# Altium schematic sheet ESP32_LHCbit.SchDoc
size A3; SheetNumber: 1
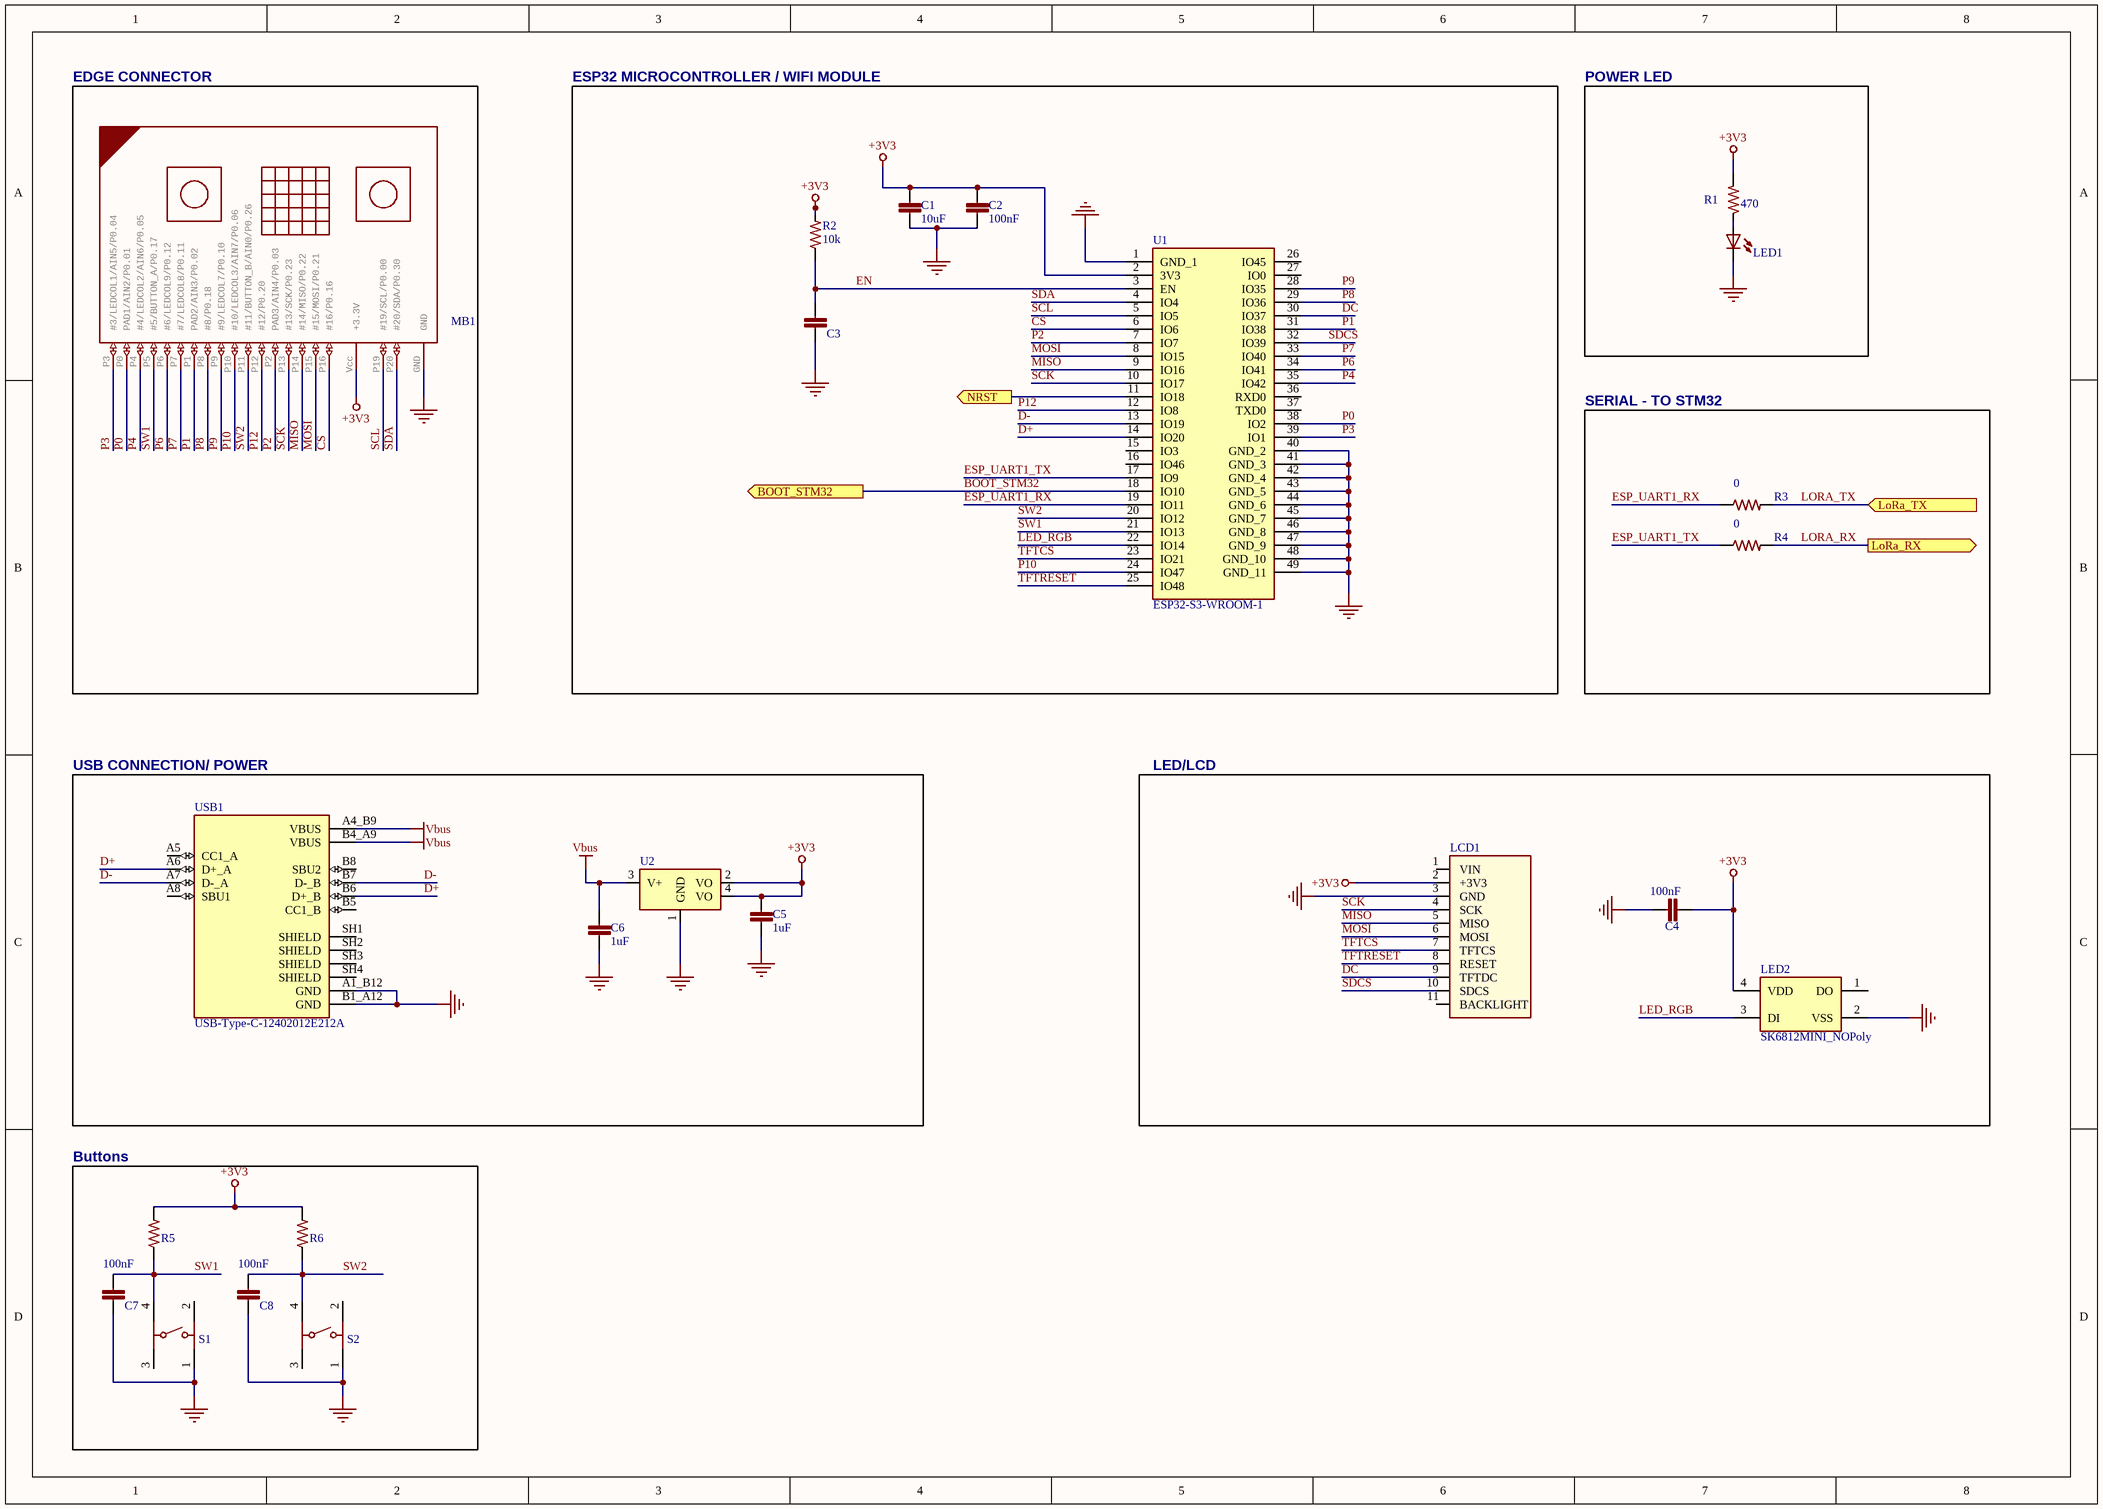
[diagram p0: ESP32_LHCbit.SchDoc]

## Parts
C1  value 10uF  [C0603]  (hidden comment: C-EUC0603)
C2  value 100nF  [C0603]  (hidden comment: C-EUC0603)
C3  C-EUC0402  [C0402]  (value not drawn)
C4  value 100nF  [C0402]  (hidden comment: C-EUC0402)
C5  value 1uF  [C0603]  (hidden comment: C-EUC0603)
C6  value 1uF  [C0603]  (hidden comment: C-EUC0603)
C7  value 100nF  [C0402]  (hidden comment: C-EUC0402)
C8  value 100nF  [C0402]  (hidden comment: C-EUC0402)
LCD1  Adafruit 0.96"  TFT LCD  [ADafruit 0.96 Display]  (value not drawn)
LED1  (no value)  [CHIPLED_0805]
LED2  SK6812MINI_NOPoly  [WS2812BMINI_no_poly]
MB1  MICRO:BIT_EDGE  [MICROBIT_EDGE]  (value not drawn)  (no BOM)
R1  value 470  [R0603]  (hidden comment: R-US_R0603)
R2  value 10k  [R0402]  (hidden comment: R-US_R0402)
R3  value 0  [R0402]  (hidden comment: R-US_R0402)
R4  value 0  [R0402]  (hidden comment: R-US_R0402)
R5  R-US_R0402  [R0402]  (value not drawn)
R6  R-US_R0402  [R0402]  (value not drawn)
S1  DTSM-6  [4301x20438x6_6x6x4.3_DTSM-6]  (value not drawn)
S2  DTSM-6  [4301x20438x6_6x6x4.3_DTSM-6]  (value not drawn)
U1  ESP32-S3-WROOM-1  [ESP32S3WROOM1N16R2]
U2  NCP1117LP  [SOT223]  (value not drawn)
USB1  USB-Type-C-12402012E212A  [AMPHENOL_12402012E212A]

## Blocks framed on the sheet
EDGE CONNECTOR: MB1
ESP32 MICROCONTROLLER / WIFI MODULE: C1-C3 R2 U1
POWER LED: LED1 R1
SERIAL - TO STM32: R3 R4
USB CONNECTION/ POWER: C5 C6 U2 USB1
LED/LCD: C4 LCD1 LED2
Buttons: C7 C8 R5 R6 S1 S2

## Ports
BOOT_STM32 (out), LoRa_RX (out), LoRa_TX (in), NRST (out)

## Nets
+3V3: C1.1 C2.1 C4.2 C5.1 LCD1.2(+3V3) LED2.4(VDD) MB1.Vcc(+3.3V) R1.2 R2.2 R5.2 R6.2 U1.2(3V3) U2.2(VO) U2.4(VO)
GND: C1.2 C2.2 C3.2 C4.1 C5.2 C6.2 C7.2 C8.2 LCD1.3(GND) LED1.C LED2.2(VSS) MB1.GND S1.1 S2.1 U1.1(GND_1) U1.40(GND_2) U1.41(GND_3) U1.42(GND_4) U1.43(GND_5) U1.44(GND_6) U1.45(GND_7) U1.46(GND_8) U1.47(GND_9) U1.48(GND_10) U1.49(GND_11) U2.1(GND) USB1.A1_B12(GND) USB1.B1_A12(GND)
Vbus: C6.1 U2.3(V+) USB1.A4_B9(VBUS) USB1.B4_A9(VBUS)
BOOT_STM32: U1.18(IO10) ; port BOOT_STM32
CS: MB1.P16(#16/P0.16) U1.6(IO6)
D+: U1.14(IO20) USB1.A6(D+_A) USB1.B6(D+_B)
D-: U1.13(IO19) USB1.A7(D-_A) USB1.B7(D-_B)
DC: LCD1.9(TFTDC) U1.30(IO37)
EN: C3.1 R2.1 U1.3(EN)
ESP_UART1_RX: R3.1 U1.19(IO11)
ESP_UART1_TX: R4.1 U1.17(IO9)
LED_RGB: LED2.3(DI) U1.22(IO14)
LORA_RX: R4.2 ; port LoRa_RX
LORA_TX: R3.2 ; port LoRa_TX
MISO: LCD1.5(MISO) MB1.P14(#14/MISO/P0.22) U1.9(IO16)
MOSI: LCD1.6(MOSI) MB1.P15(#15/MOSI/P0.21) U1.8(IO15)
NRST: U1.11(IO18) ; port NRST
P0: MB1.P0(PAD1/AIN2/P0.01) U1.38(IO2)
P1: MB1.P1(PAD2/AIN3/P0.02) U1.31(IO38)
P2: MB1.P2(PAD3/AIN4/P0.03) U1.7(IO7)
P3: MB1.P3(#3/LEDCOL1/AIN5/P0.04) U1.39(IO1)
P4: MB1.P4(#4/LEDCOL2/AIN6/P0.05) U1.35(IO42)
P6: MB1.P6(#6/LEDCOL9/P0.12) U1.34(IO41)
P7: MB1.P7(#7/LEDCOL8/P0.11) U1.33(IO40)
P8: MB1.P8(#8/P0.18) U1.29(IO36)
P9: MB1.P9(#9/LEDCOL7/P0.10) U1.28(IO35)
P10: MB1.P10(#10/LEDCOL3/AIN7/P0.06) U1.24(IO47)
P12: MB1.P12(#12/P0.20) U1.12(IO8)
SCK: LCD1.4(SCK) MB1.P13(#13/SCK/P0.23) U1.10(IO17)
SCL: MB1.P19(#19/SCL/P0.00) U1.5(IO5)
SDA: MB1.P20(#20/SDA/P0.30) U1.4(IO4)
SDCS: LCD1.10(SDCS) U1.32(IO39)
SW1: C7.1 MB1.P5(#5/BUTTON_A/P0.17) R5.1 S1.4 U1.21(IO13)
SW2: C8.1 MB1.P11(#11/BUTTON_B/AIN0/P0.26) R6.1 S2.4 U1.20(IO12)
TFTCS: LCD1.7(TFTCS) U1.23(IO21)
TFTRESET: LCD1.8(RESET) U1.25(IO48)
NetLED1_A: LED1.A R1.1

Not connected (* = marked no-connect by the designer): LCD1 1(VIN) 11(BACKLIGHT); LED2 1(DO); S1 2 3; S2 2 3; U1 15(IO3) 16(IO46) 26(IO45) 27(IO0) 36(RXD0) 37(TXD0); USB1 A5(CC1_A) A8(SBU1) B5(CC1_B) B8(SBU2) SH1(SHIELD) SH2(SHIELD) SH3(SHIELD) SH4(SHIELD)

## Library data of the parts
C1 = C-EUC0603: Part Number: CL10A106KP8NNNC; Vendor: Samsung; Família: Capacitor
C2 = C-EUC0603: Part Number: CC0603KRX7R9BB104; Vendor: YAGEO; Família: Capacitor
C3 = C-EUC0402: Part Number: C0402C104K8; Value: 100nF; Vendor: KEMET; Família: Capacitor
C4 C7 C8 = C-EUC0402: Part Number: C0402C104K8; Vendor: KEMET; Família: Capacitor
C5 C6 = C-EUC0603: Part Number: CL10A105KO8NNNC; Vendor: Samsung; Família: Capacitor
LED1 = LEDCHIPLED_0805: Part Number: AP2012EC; Vendor: Kingbright; Família: LED
LED2 = SK6812MINI_NOPoly: SMD RGB (WS2812/SK6812MINI) 3535; Família: LED; Vendor: *; Value: *; Part Number: SK6812MINI
R1 = R-US_R0603: Part Number: RC0603FR-07470RL; Vendor: Yageo
R2 = R-US_R0402: Part Number: RC0402FR-0710KL; Vendor: YAGEO; Família: Resistor
R3 R4 = R-US_R0402: Part Number: PA0402-R-070RL; Vendor: YAGEO; Família: Resistor
R5 R6 = R-US_R0402: Part Number: RC0402FR-0710KL; Value: 10k; Vendor: YAGEO; Família: Resistor
S1 S2 = DTSM-6: WS-TASV 6x6mm Tact Switch, SMD version; Vendor: Wurth Elektronik; Família: Switches; Part Number: DTSM-6
U1 = ESP32-S3-WROOM-1: Integrated Circuit; Part Number: ESP32-S3-WROOM-1-N16R2; Vendor: Espressif; Família: IC
U2 = NCP1117LP: Part Number: TLV1117LV33DCYR; Vendor: Texas Instruments
USB1 = USB-Type-C-12402012E212A: USB2.0, Type C; Part Number: TYPEC-304-ACP16; Família: Connector; Vendor: XUNPU; Value: *